# EAGLE schematic rectifier (EAGLE 8.0.0)
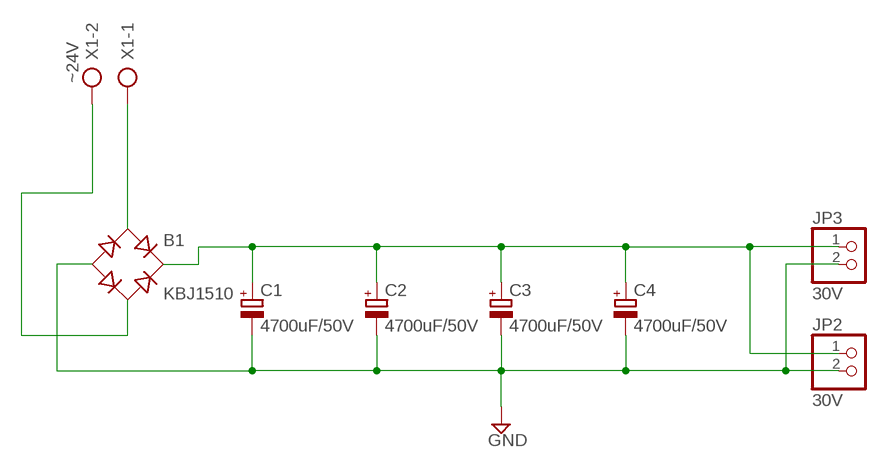
[diagram p0: schematic, sheet 1]

## Parts
B1  KBJ1510  RECTIFIER-FB32  [FB32]
C1  4700uF/50V  CPOL-EUE10-20  [EB20D]
C2  4700uF/50V  CPOL-EUE10-20  [EB20D]
C3  4700uF/50V  CPOL-EUE10-20  [EB20D]
C4  4700uF/50V  CPOL-EUE10-20  [EB20D]
JP2  30V  PINHD-1X2  [1X02]
JP3  30V  PINHD-1X2  [1X02]
X1  ~24V  AK500/2  [AK500/2]

## Nets
GND: B1.- C1.- C2.- C3.- C4.- JP2.2 JP3.2
N$1: B1.AC2 X1.2
N$2: B1.AC1 X1.1
N$3: B1.+ C1.+ C2.+ C3.+ C4.+ JP2.1 JP3.1

## Library data of the parts
B1 = rectifier:RECTIFIER-: Rectifier
C1-C4 = rcl:CPOL-EU: POLARIZED CAPACITOR, European symbol
JP2 JP3 = pinhead:PINHD-1X2: PIN HEADER
X1 = con-ptr500:AK500/2: CONNECTOR; OC_FARNELL: unknown; OC_NEWARK: unknown